# Altium project DAC904.PrjPcb
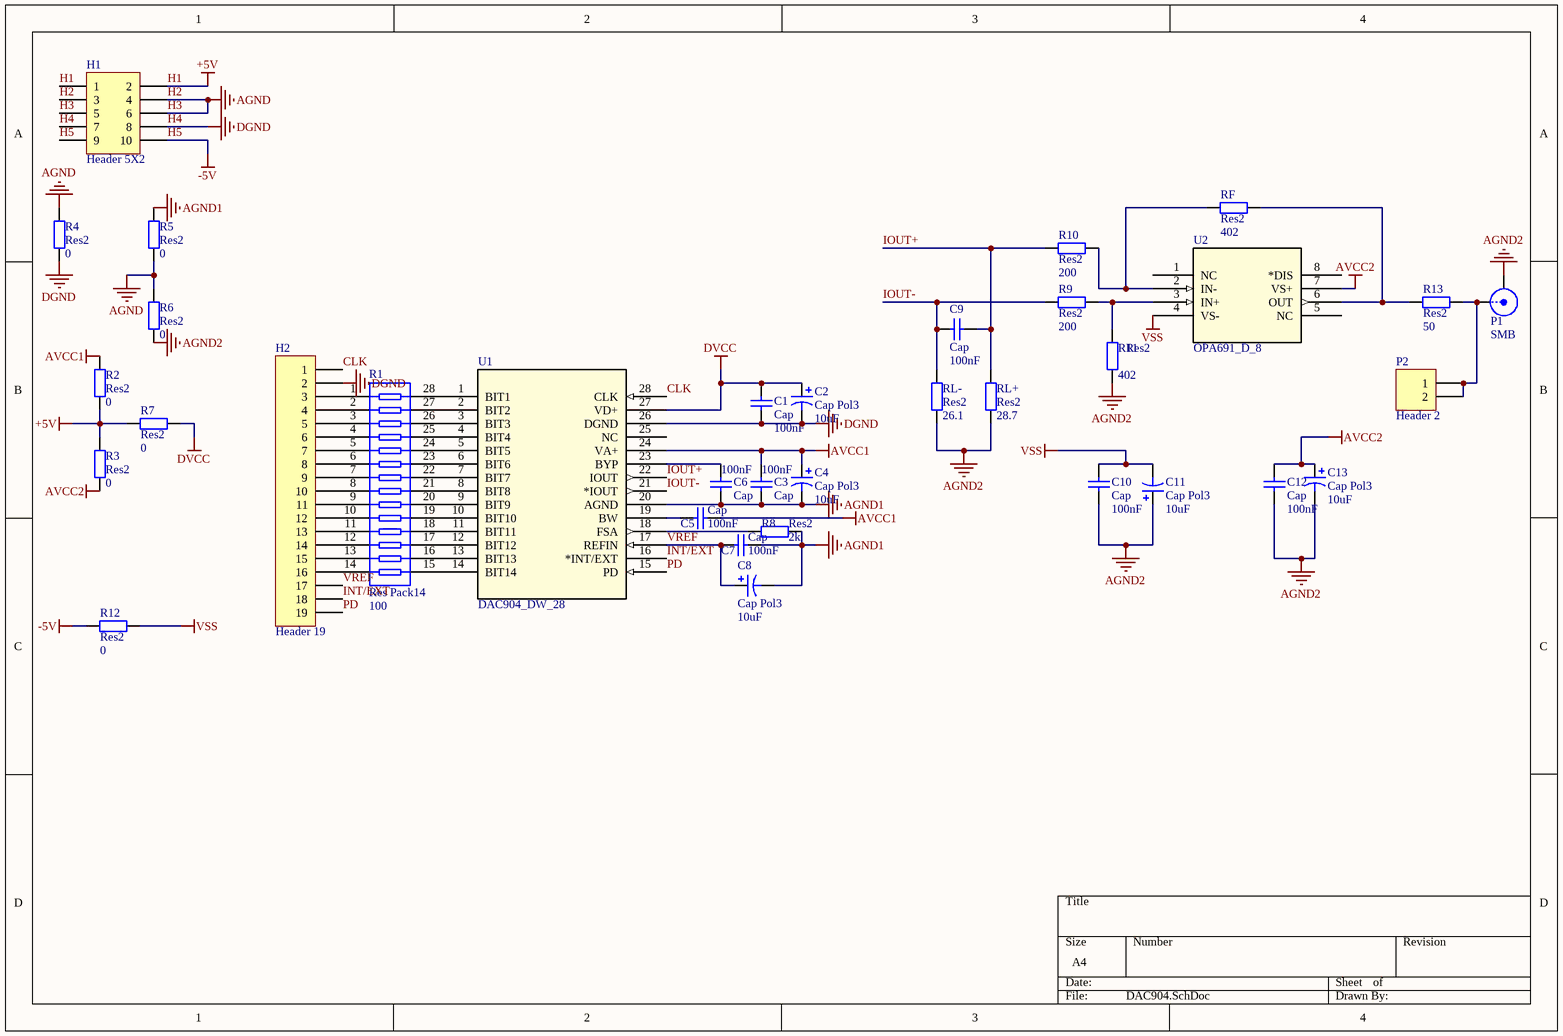
[diagram p0: DAC904.SchDoc]
1 sheet, 35 parts. Net scope: global (net labels, ports and power ports of the same name join across sheets).
Board file: DAC904.PcbDoc

## Sheet DAC904.SchDoc
size A4

### Parts
C1  Cap  value 100nF  [C0805]
C2  Cap Pol3  value 10uF  [CAP_SMD_3216]
C3  Cap  value 100nF  [C0805]
C4  Cap Pol3  value 10uF  [CAP_SMD_3216]
C5  Cap  value 100nF  [C0805]
C6  Cap  value 100nF  [C0805]
C7  Cap  value 100nF  [C0805]
C8  Cap Pol3  value 10uF  [CAP_SMD_3216]
C9  Cap  value 100nF  [C0805]
C10  Cap  value 100nF  [C0805]
C11  Cap Pol3  value 10uF  [CAP_SMD_3216]
C12  Cap  value 100nF  [C0805]
C13  Cap Pol3  value 10uF  [CAP_SMD_3216]
H1  Header 5X2  [HDR2X5]
H2  Header 19  [HDR1X19]
P1  SMB  [SMB_V-RJ45]
P2  Header 2  [HDR1X2]
R1  Res Pack14  value 100  [ResPack14]
R2  Res2  value 0  [6-0805_N]
R3  Res2  value 0  [6-0805_N]
R4  Res2  value 0  [6-0805_N]
R5  Res2  value 0  [6-0805_N]
R6  Res2  value 0  [6-0805_N]
R7  Res2  value 0  [6-0805_N]
R8  Res2  value 2k  [6-0805_N]
R9  Res2  value 200  [6-0805_N]
R10  Res2  value 200  [6-0805_N]
R11  Res2  value 402  [6-0805_N]
R12  Res2  value 0  [6-0805_N]
R13  Res2  value 50  [6-0805_N]
RF  Res2  value 402  [6-0805_N]
RL+  Res2  value 28.7  [6-0805_N]
RL-  Res2  value 26.1  [6-0805_N]
U1  DAC904_DW_28  [PW28]
U2  OPA691_D_8  [D8]

### Nets
AGND1: C3.1 C4.2 C6.2 C7.1 C8.2 R5.2 R8.1 U1.20(AGND)
AGND2: C10.1 C11.1 C12.1 C13.2 P1.2(Y) R6.1 R11.2 RL+.2 RL-.2
AVCC1: C3.2 C4.1 C5.1 R2.2 U1.24(VA+)
AVCC2: C12.2 C13.1 R3.1 U2.7(VS+)
DVCC: C1.2 C2.1 R7.1 U1.27(VD+)
H1: H1.1 H1.2 R2.1 R3.2 R7.2  [also labelled +5V]
H2: H1.3 H1.4 H1.5 H1.6 R4.1 R5.1 R6.2  [also labelled AGND, H3]
H4: C1.1 C2.2 H1.7 H1.8 H2.2 R4.2 U1.26(DGND)  [also labelled DGND]
H5: H1.9 H1.10 R12.2  [also labelled -5V]
VSS: C10.2 C11.2 R12.1 U2.4(VS-)
CLK: H2.1 U1.28(CLK)
INT/EXT: H2.18 U1.16(*INT/EXT)
IOUT+: C9.1 R10.2 RL+.1 U1.22(IOUT)
IOUT-: C9.2 R9.2 RL-.1 U1.21(*IOUT)
PD: H2.19 U1.15(PD)
VREF: C7.2 C8.1 H2.17 U1.17(REFIN)
NetC5_2: C5.2 U1.19(BW)
NetC6_1: C6.1 U1.23(BYP)
NetH2_3: H2.3 R1.1
NetH2_4: H2.4 R1.2
NetH2_5: H2.5 R1.3
NetH2_6: H2.6 R1.4
NetH2_7: H2.7 R1.5
NetH2_8: H2.8 R1.6
NetH2_9: H2.9 R1.7
NetH2_10: H2.10 R1.8
NetH2_11: H2.11 R1.9
NetH2_12: H2.12 R1.10
NetH2_13: H2.13 R1.11
NetH2_14: H2.14 R1.12
NetH2_15: H2.15 R1.13
NetH2_16: H2.16 R1.14
NetP1_1: P1.1(X) P2.1 P2.2 R13.1
NetR1_15: R1.15 U1.14(BIT14)
NetR1_16: R1.16 U1.13(BIT13)
NetR1_17: R1.17 U1.12(BIT12)
NetR1_18: R1.18 U1.11(BIT11)
NetR1_19: R1.19 U1.10(BIT10)
NetR1_20: R1.20 U1.9(BIT9)
NetR1_21: R1.21 U1.8(BIT8)
NetR1_22: R1.22 U1.7(BIT7)
NetR1_23: R1.23 U1.6(BIT6)
NetR1_24: R1.24 U1.5(BIT5)
NetR1_25: R1.25 U1.4(BIT4)
NetR1_26: R1.26 U1.3(BIT3)
NetR1_27: R1.27 U1.2(BIT2)
NetR1_28: R1.28 U1.1(BIT1)
NetR8_2: R8.2 U1.18(FSA)
NetR9_1: R9.1 R11.1 U2.3(IN+)
NetR10_1: R10.1 RF.2 U2.2(IN-)
NetR13_2: R13.2 RF.1 U2.6(OUT)

Not connected (* = marked no-connect by the designer): U1 25(NC); U2 1(NC) 5(NC) 8(*DIS)

### Library data of the parts
C1 C3 C5-C7 C9 C10 C12 = Cap: Capacitor; Published: 8-Jun-2000; LatestRevisionDate: 17-Jul-2002; LatestRevisionNote: Re-released for DXP Platform.; PackageReference: RAD-0.3; Publisher: Altium Limited; PackageDescription: Radial Cap, Thru-Hole; 2 Leads; 0.3 in Pin Spacing
C2 C4 C8 C11 C13 = Cap Pol3: Polarized Capacitor (Surface Mount); Published: 8-Jun-2000; LatestRevisionDate: 29-May-2009; LatestRevisionNote: IPC-7351 Footprint Added.; PackageReference: C0805; Publisher: Altium Limited; PackageDescription: Chip Capacitor
H1 = Header 5X2: Header, 5-Pin, Dual row; LatestRevisionDate: 17-Jul-2002; LatestRevisionNote: Re-released for DXP Platform.; Publisher: Altium Limited
H2 = Header 19: Header, 19-Pin; LatestRevisionDate: 17-Jul-2002; LatestRevisionNote: Re-released for DXP Platform.; Publisher: Altium Limited
P1 = SMB: SMB Straight Connector; LatestRevisionDate: 17-Jul-2002; LatestRevisionNote: Re-released for DXP Platform.; Publisher: Altium Limited
P2 = Header 2: Header, 2-Pin; LatestRevisionDate: 17-Jul-2002; LatestRevisionNote: Re-released for DXP Platform.; Publisher: Altium Limited
R1 = Res Pack14: Isolated Resistor Network; Published: 24-Mar-1999; LatestRevisionDate: 29-May-2009; LatestRevisionNote: IPC-7351 Footprint Added.; PackageVersion: Oct-2003; PackageReference: SSOP16; Publisher: Altium Limited; PackageDescription: 16-Pin Plastic Small Outline Package 0.65 mm Pitch; Code_JEDEC: MO-150-AC; Code_IPC: SOP65P780-16
R2-R13 RF RL+ RL- = Res2: Resistor; Published: 8-Jun-2000; LatestRevisionDate: 17-Jul-2002; LatestRevisionNote: Re-released for DXP Platform.; PackageReference: AXIAL-0.4; Publisher: Altium Limited; PackageDescription: Axial Device, Thru-Hole; 2 Leads; 0.4 in Pin Spacing
U1 = DAC904_DW_28: Imported; Manufacturer: Texas Instruments; GENERIC_PART_NUMBER: DAC904; INDUSTRY_STD_PKG_TYPE: SOIC; FAMILY_NAME: HIGH SPEED DAC (>10MSPS); PIN_COUNT: 28; PACKAGE_DESIGNATOR: DW; Datasheet_URL: http://www.ti.com/lit/gpn/DAC904; Vendor: Texas Instruments; Manufacturer_Part_Number: dac904_dw_28; Value: Value; Type: Type; RefDes: RefDes
U2 = OPA691_D_8: Imported; Manufacturer: Texas Instruments; GENERIC_PART_NUMBER: OPA691; INDUSTRY_STD_PKG_TYPE: SOIC; FAMILY_NAME: CURRENT FEEDBACK; PIN_COUNT: 8; PACKAGE_DESIGNATOR: D; Datasheet_URL: http://www.ti.com/lit/gpn/OPA691; Vendor: Texas Instruments; Manufacturer_Part_Number: opa691_d_8; Value: Value; Type: Type; RefDes: RefDes